# Altium schematic sheet STM32F103VET6.SchDoc
size A4
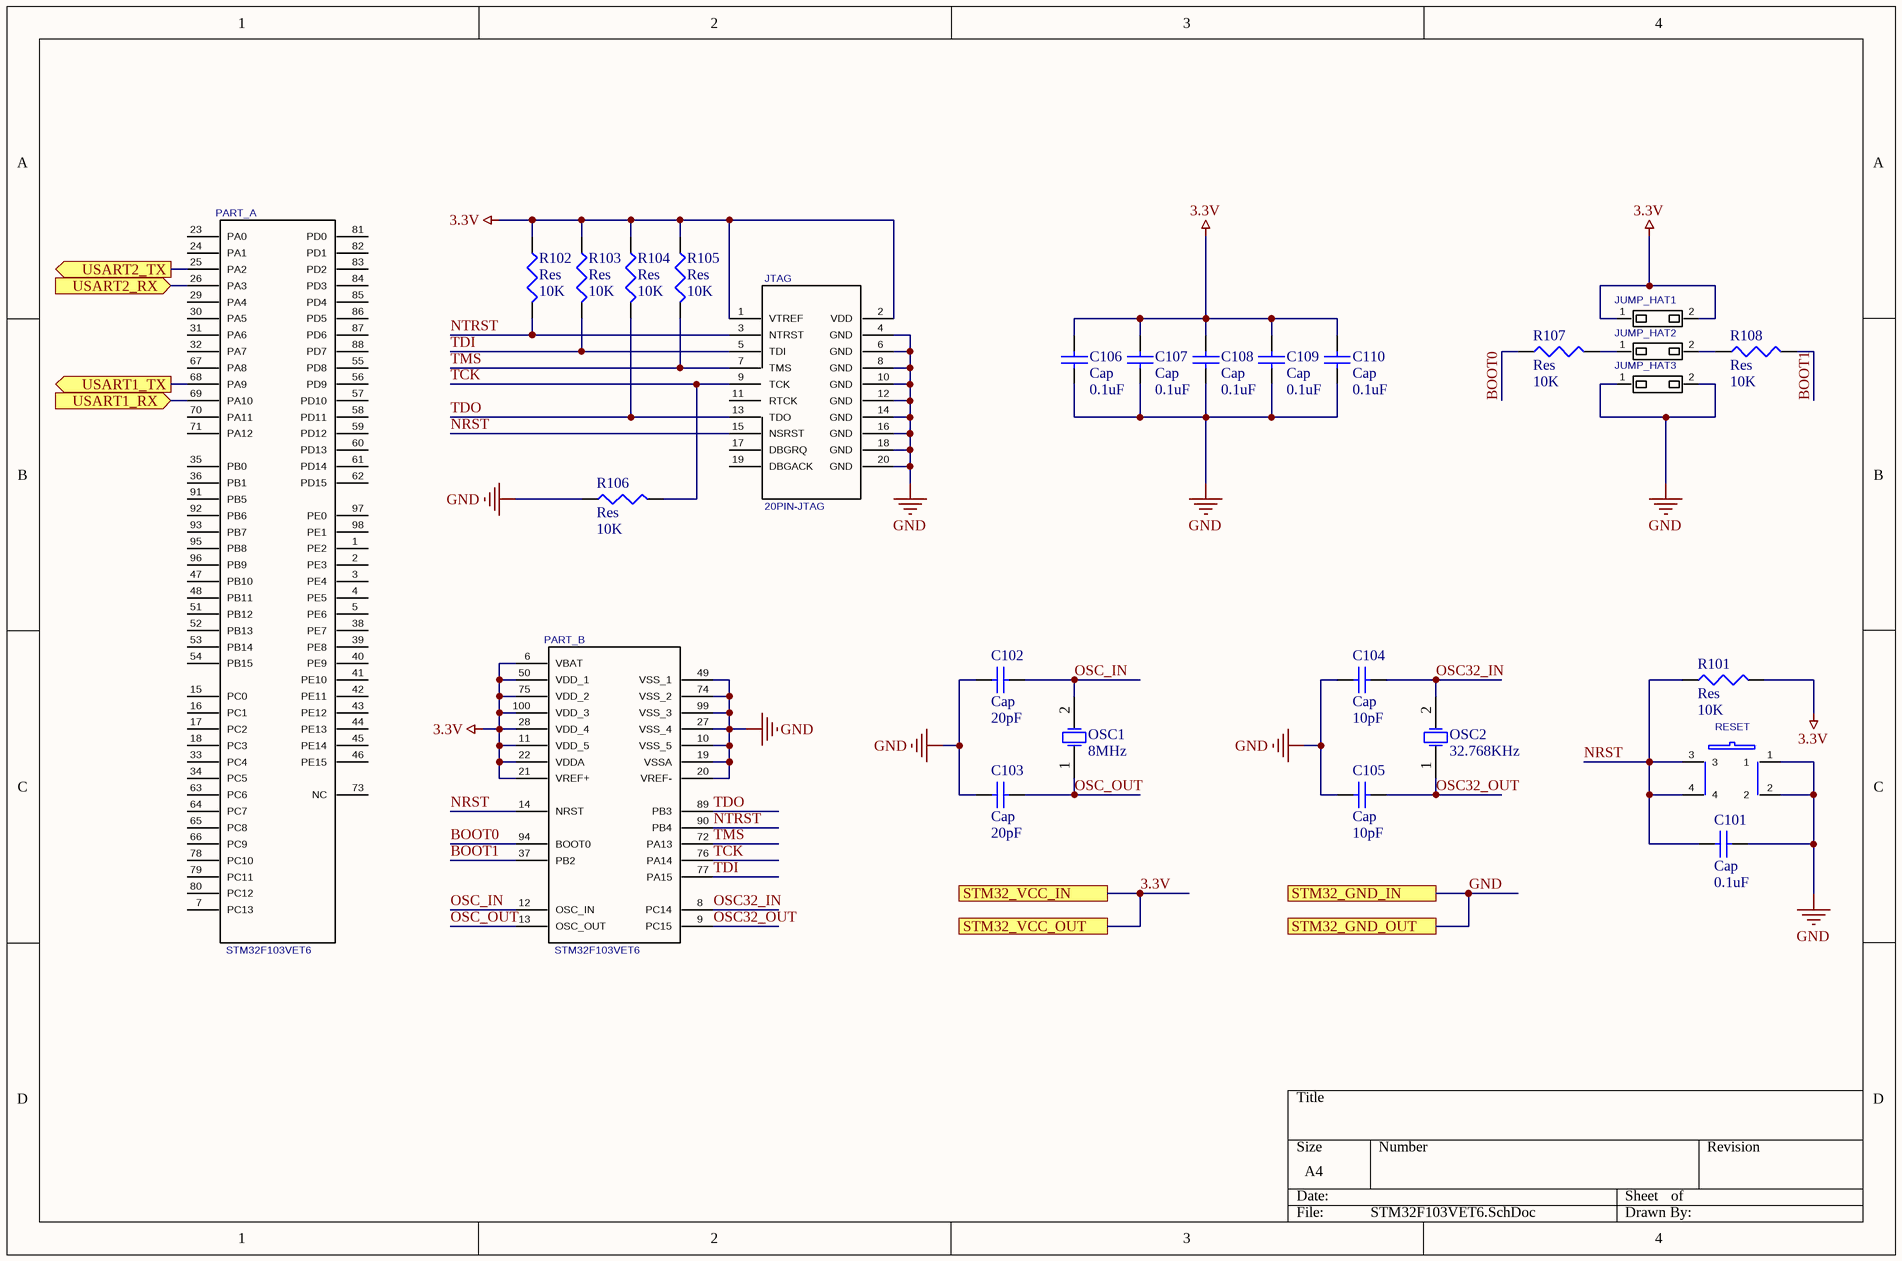
[diagram p0: STM32F103VET6.SchDoc]

## Parts
C101  Cap  value 0.1uF  [RAD-0.3]
C102  Cap  value 20pF  [RAD-0.3]
C103  Cap  value 20pF  [RAD-0.3]
C104  Cap  value 10pF  [RAD-0.3]
C105  Cap  value 10pF  [RAD-0.3]
C106  Cap  value 0.1uF  [RAD-0.3]
C107  Cap  value 0.1uF  [RAD-0.3]
C108  Cap  value 0.1uF  [RAD-0.3]
C109  Cap  value 0.1uF  [RAD-0.3]
C110  Cap  value 0.1uF  [RAD-0.3]
JTAG  20PIN-JTAG  [FC20H]
JUMP_HAT1  1X2PIN_SMD  [1X2PIN_SMD]  (value not drawn)
JUMP_HAT2  1X2PIN_SMD  [1X2PIN_SMD]  (value not drawn)
JUMP_HAT3  1X2PIN_SMD  [1X2PIN_SMD]  (value not drawn)
OSC1  8MHz  [R38]
OSC2  32.768KHz  [R38]
PART_  STM32F103VET6  [STM32F103VET6-LQFP]  (parts A,B of 2)
R101  Res  value 10K  [J1-0603]
R102  Res  value 10K  [J1-0603]
R103  Res  value 10K  [J1-0603]
R104  Res  value 10K  [J1-0603]
R105  Res  value 10K  [J1-0603]
R106  Res  value 10K  [J1-0603]
R107  Res  value 10K  [J1-0603]
R108  Res  value 10K  [J1-0603]
RESET  KEY  [SW6.2/6.2-SMD]  (value not drawn)

## Ports
STM32_GND_IN, STM32_GND_OUT, STM32_VCC_IN, STM32_VCC_OUT, USART1_RX (in), USART1_TX (out), USART2_RX (in), USART2_TX (out)

## Nets
3.3V: C106.2 C107.2 C108.2 C109.2 C110.2 JTAG.1(VTREF) JTAG.2(VDD) JUMP_HAT1.1 JUMP_HAT1.2 PART_.6(VBAT) PART_.11(VDD_5) PART_.21(VREF+) PART_.22(VDDA) PART_.28(VDD_4) PART_.50(VDD_1) PART_.75(VDD_2) PART_.100(VDD_3) R101.2 R102.1 R103.1 R104.1 R105.1 ; port STM32_VCC_IN, port STM32_VCC_OUT
GND: C101.2 C102.1 C103.1 C104.1 C105.1 C106.1 C107.1 C108.1 C109.1 C110.1 JTAG.4(GND) JTAG.6(GND) JTAG.8(GND) JTAG.10(GND) JTAG.12(GND) JTAG.14(GND) JTAG.16(GND) JTAG.18(GND) JTAG.20(GND) JUMP_HAT3.1 JUMP_HAT3.2 PART_.10(VSS_5) PART_.19(VSSA) PART_.20(VREF-) PART_.27(VSS_4) PART_.49(VSS_1) PART_.74(VSS_2) PART_.99(VSS_3) R106.1 RESET.1 RESET.2 ; port STM32_GND_IN, port STM32_GND_OUT
BOOT0: PART_.94(BOOT0) R107.1
BOOT1: PART_.37(PB2) R108.1
NRST: C101.1 JTAG.15(NSRST) PART_.14(NRST) R101.1 RESET.3 RESET.4
NTRST: JTAG.3(NTRST) PART_.90(PB4) R102.2
OSC32_IN: C104.2 OSC2.2(OSC2) PART_.8(PC14)
OSC32_OUT: C105.2 OSC2.1(OSC1) PART_.9(PC15)
OSC_IN: C102.2 OSC1.2(OSC2) PART_.12(OSC_IN)
OSC_OUT: C103.2 OSC1.1(OSC1) PART_.13(OSC_OUT)
TCK: JTAG.9(TCK) PART_.76(PA14) R106.2
TDI: JTAG.5(TDI) PART_.77(PA15) R103.2
TDO: JTAG.13(TDO) PART_.89(PB3) R104.2
TMS: JTAG.7(TMS) PART_.72(PA13) R105.2
USART1_RX: PART_.69(PA10) ; port USART1_RX
USART1_TX: PART_.68(PA9) ; port USART1_TX
USART2_RX: PART_.26(PA3) ; port USART2_RX
USART2_TX: PART_.25(PA2) ; port USART2_TX
NetJUMP_HAT2_1: JUMP_HAT2.1 R107.2
NetJUMP_HAT2_2: JUMP_HAT2.2 R108.2

Not connected (* = marked no-connect by the designer): JTAG 11(RTCK) 17(DBGRQ) 19(DBGACK); PART_ 1(PE2) 2(PE3) 3(PE4) 4(PE5) 5(PE6) 7(PC13) 15(PC0) 16(PC1) 17(PC2) 18(PC3) 23(PA0) 24(PA1) 29(PA4) 30(PA5) 31(PA6) 32(PA7) 33(PC4) 34(PC5) 35(PB0) 36(PB1) 38(PE7) 39(PE8) 40(PE9) 41(PE10) 42(PE11) 43(PE12) 44(PE13) 45(PE14) 46(PE15) 47(PB10) 48(PB11) 51(PB12) 52(PB13) 53(PB14) 54(PB15) 55(PD8) 56(PD9) 57(PD10) 58(PD11) 59(PD12) 60(PD13) 61(PD14) 62(PD15) 63(PC6) 64(PC7) 65(PC8) 66(PC9) 67(PA8) 70(PA11) 71(PA12) 73(NC) 78(PC10) 79(PC11) 80(PC12) 81(PD0) 82(PD1) 83(PD2) 84(PD3) 85(PD4) 86(PD5) 87(PD6) 88(PD7) 91(PB5) 92(PB6) 93(PB7) 95(PB8) 96(PB9) 97(PE0) 98(PE1)

## Library data of the parts
C101-C110 = Cap: Capacitor; Published: 8-Jun-2000; LatestRevisionDate: 17-Jul-2002; LatestRevisionNote: Re-released for DXP Platform.; PackageReference: RAD-0.3; Publisher: Altium Limited; PackageDescription: Radial Cap, Thru-Hole; 2 Leads; 0.3 in Pin Spacing
JTAG = 20PIN-JTAG: 20pin JTAG; Manufacturer #1: 20pin JTAG; Manufacturer #1 PN: 20pin JTAG; Value: 20pin JTAG; PCB DECAL: FC20H
OSC1 OSC2 = XTAL: Crystal Oscillator; Published: 8-Jun-2000; LatestRevisionDate: 17-Jul-2002; LatestRevisionNote: Re-released for DXP Platform.; PackageReference: R38; Publisher: Altium Limited; PackageDescription: Crystal, Thru-Hole; 2 Leads; Body 3.1 x 8.2 mm (Dia.xH)
PART_ = STM32F103VET6: Geometry.Height: 62.99mil; Protel.FootprintDescription: TSQFP, 100-Leads, Body 16.2x16.2mm (max), Pitch 0.50mm, IP; Value: STM32F103VET6; PCB DECAL: STM32F103VET6-LQFP
R101-R108 = Res3: Resistor; Published: 8-Jun-2000; LatestRevisionDate: 29-May-2009; LatestRevisionNote: IPC-7351 Footprint Added.; PackageReference: J1-0603; Publisher: Altium Limited; PackageDescription: Chip Resistor
JUMP_HAT1-JUMP_HAT3 = 1X2PIN_SMD: PCB DECAL: 1X2PIN_SMD
RESET = KEY: Manufacturer #1 PN: KEY; PCB DECAL: SW6.2/6.2-SMD